# Altium project Modul_analogowy.PrjPcb
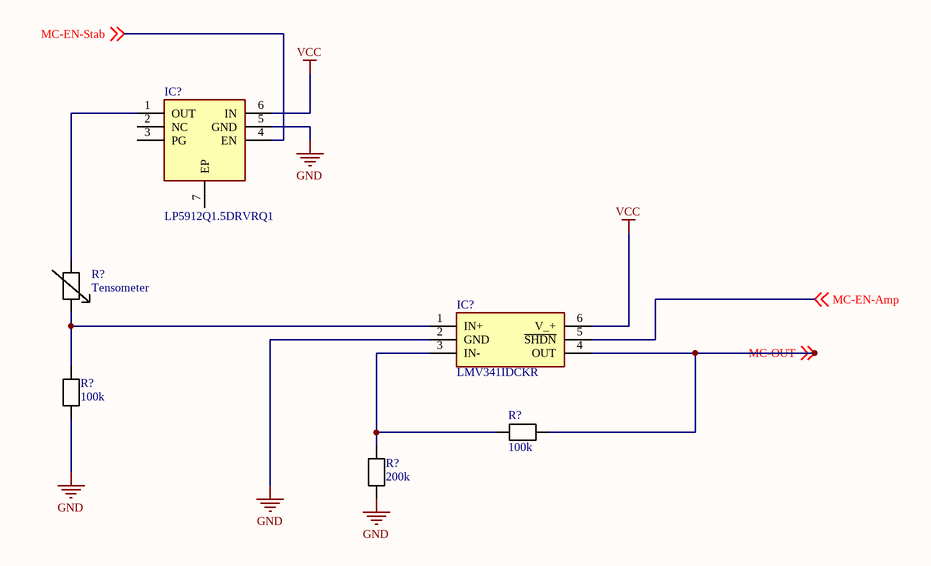
[diagram p0: SchematicTensometr.SchDoc]
1 sheet, 6 parts. Net scope: global (net labels, ports and power ports of the same name join across sheets).

## Sheet SchematicTensometr.SchDoc
size 292 x 193 mm; SheetNumber: 1; SheetTotal: 1

### Parts
(Parts that share a designator on the sheet are numbered #1, #2 ... from top to bottom, then left to right.)
IC?#1  LP5912Q1.5DRVRQ1  [SON65P200X200X80-7N]
IC?#2  LMV341IDCKR  [SOT65P210X110-6N]
R?#1  Tensometer
R?#2  100k
R?#3  100k
R?#4  200k

### Nets
GND: IC?#1.5(GND) IC?#2.2(GND) R?#2.2 R?#4.2
VCC: IC?#1.6(IN) IC?#2.6(V_+)
MC-EN-Amp: IC?#2.5(~{SHDN}) ; off-sheet MC-EN-Amp
MC-EN-Stab: IC?#1.4(EN) ; off-sheet MC-EN-Stab
MC-OUT: IC?#2.4(OUT) R?#3.1 ; off-sheet MC-OUT
NetIC?#1_1: IC?#1.1(OUT) R?#1.2
NetIC?#2_1: IC?#2.1(IN+) R?#1.1 R?#2.1
NetIC?#2_3: IC?#2.3(IN-) R?#3.2 R?#4.1

Not connected (* = marked no-connect by the designer): IC?#1 2(NC) 3(PG) 7(EP)

### Notes on the sheet
- Data:
- Tytuł:
- Rev.:
- Rozm.:
- A4
- Strona:
- z
- PBL4
- Opracował:

### Library data of the parts
IC?#1 = LP5912Q1.5DRVRQ1: Integrated Circuit; Manufacturer_Name: Texas Instruments; Datasheet Link: http://www.ti.com/lit/gpn/lp5912-q1; Height: 0.8mm; Manufacturer_Part_Number: LP5912Q1.5DRVRQ1; Mouser Part Number: 595-LP5912Q1.5DRVRQ1; Mouser Price/Stock: https://www.mouser.co.uk/ProductDetail/Texas-Instruments/LP5912Q15DRVRQ1?qs=n%252BTO0c4TDSYVegszUJ4LKA%3D%3D; Arrow Part Number: LP5912Q1.5DRVRQ1; Arrow Price/Stock: https://www.arrow.com/en/products/lp5912q1.5drvrq1/texas-instruments
IC?#2 = LMV341IDCKR: Integrated Circuit; Manufacturer_Name: Texas Instruments; Datasheet Link: http://www.ti.com/lit/gpn/lmv341; Height: 1.1mm; Manufacturer_Part_Number: LMV341IDCKR; Mouser Part Number: 595-LMV341IDCKR; Mouser Price/Stock: https://www.mouser.co.uk/ProductDetail/Texas-Instruments/LMV341IDCKR/?qs=paYhMW8qfiso3OfEEvyk%2Fg%3D%3D; Arrow Part Number: LMV341IDCKR; Arrow Price/Stock: https://www.arrow.com/en/products/lmv341idckr/texas-instruments
R?#2-R?#4 = Resistor